# EAGLE schematic Dribbler (EAGLE 8.0.2)

## Sheet 1 of 2

## Sheet 2 of 2
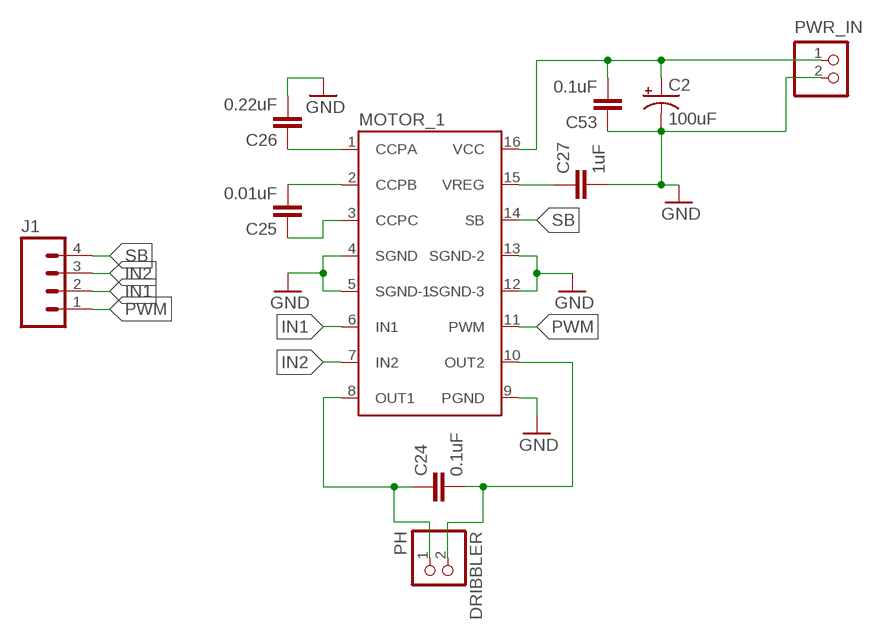
[diagram p0: schematic, sheet 2]

### Parts
C2  100uF  CAP_POLPTH1  [CPOL-RADIAL-100UF-25V]
C24  0.1uF  CAP0603-CAP  [0603-CAP]
C25  0.01uF  CAP0603-CAP  [0603-CAP]
C26  0.22uF  CAP0603-CAP  [0603-CAP]
C27  1uF  CAP0603-CAP  [0603-CAP]
C53  0.1uF  CAP0603-CAP  [0603-CAP]
DRIBBLER  PH  JST_2PIN-THM  [JST-PH-2-THM]
J1  M04PTH  [1X04]
MOTOR_1  TB6549PG  [TB6549PG]
PWR_IN  B2P-VH  [B2P-VH]

### Nets
GND: C2.2(-) C26.2 C27.2 C53.1 MOTOR_1.4(SGND) MOTOR_1.5(SGND-1) MOTOR_1.9(PGND) MOTOR_1.12(SGND-3) MOTOR_1.13(SGND-2) PWR_IN.2
IN1: J1.2 MOTOR_1.6(IN1)
IN2: J1.3 MOTOR_1.7(IN2)
MOTOR_PWR: C2.1(+) C53.2 MOTOR_1.16(VCC) PWR_IN.1
N$5: C24.1 DRIBBLER.1 MOTOR_1.8(OUT1)
N$7: C24.2 DRIBBLER.2 MOTOR_1.10(OUT2)
N$10: C25.2 MOTOR_1.2(CCPB)
N$12: C25.1 MOTOR_1.3(CCPC)
N$13: C26.1 MOTOR_1.1(CCPA)
N$15: C27.1 MOTOR_1.15(VREG)
PWM: J1.1 MOTOR_1.11(PWM)
SB: J1.4 MOTOR_1.14(SB)

## Library data of the parts
C2 = SparkFun-Capacitors:CAP_POL: Capacitor Polarized These are standard SMD and PTH capacitors. Normally 10uF, 47uF, and 100uF in electrolytic and tantalum varieties. Always verify the external diameter of the through hole cap, it varies with capacity, voltage, and manufacturer. The EIA devices should be standard.
C24-C27 C53 = SparkFun-Capacitors:CAP: Capacitor Standard 0603 ceramic capacitor, and 0.1" leaded capacitor.
DRIBBLER = adafruit:JST_2PIN: JST 2-Pin Connectors of various flavors SMT-RA (S2B-PH-SM4) 4UConnector #17311 SMT (B2B-PH-SM4) THM-RA (S2B-PH) THM (B2B-PH)
J1 = SparkFun-Connectors:M04: Header 4 Standard 4-pin 0.1" header. Use with straight break away headers (SKU : PRT-00116), right angle break away headers (PRT-00553), swiss pins (PRT-00743), machine pins (PRT-00117), and female headers (PRT-00115). Molex polarized connector foot print use with SKU : PRT-08231 with associated crimp pins and housings. 1MM SMD Version SKU: PRT-10208; PROD_ID: CONN-09696
MOTOR_1 = TB6549PG-motor-controller:TB6549PG
PWR_IN = jst-vh:B2P-VH: Wire-to-Board 3.96mm pitch top mount connector Source: http://www.jst-mfg.com/product/pdf/jpn/VH.pdf http://www.jst-mfg.com/product/detail.php?series=262